# Altium schematic sheet CPU_100M_Ethernet.SchDoc: CPU_100M_Ethernet
size A3; PageSetup: Record=PageOptions|CenterHorizontal=True|CenterVertical=True|PrintScale=1.42|XCorrection=1.00|YCorrection=1.00|PrintKind=1|BorderSize=5000000|LeftOffset=0|BottomOffset=0|Orientation=2|PaperLength=1000|PaperWidth=1000|Scale=100|PaperSource=7|PrintQuality=-4|MediaType=1|DitherType=10|PaperKind=A3|PrintScaleMode=1; Date: 18/06/2014; DrawnBy: J. Gabriel R.E.; Organization: Seven Solutions S.L.; Address1: C/Baza, Parcela 19, Nave 3; Address2: Polнgono Ind. Juncaril; Address3: 18210-Peligros-Granada; Address4: Spain; Revision: 3.4; SheetNumber: 6; SheetTotal: 23; WebAddress: www.sevensols.com; Project: White Rabbit; ProjectName: Project Name
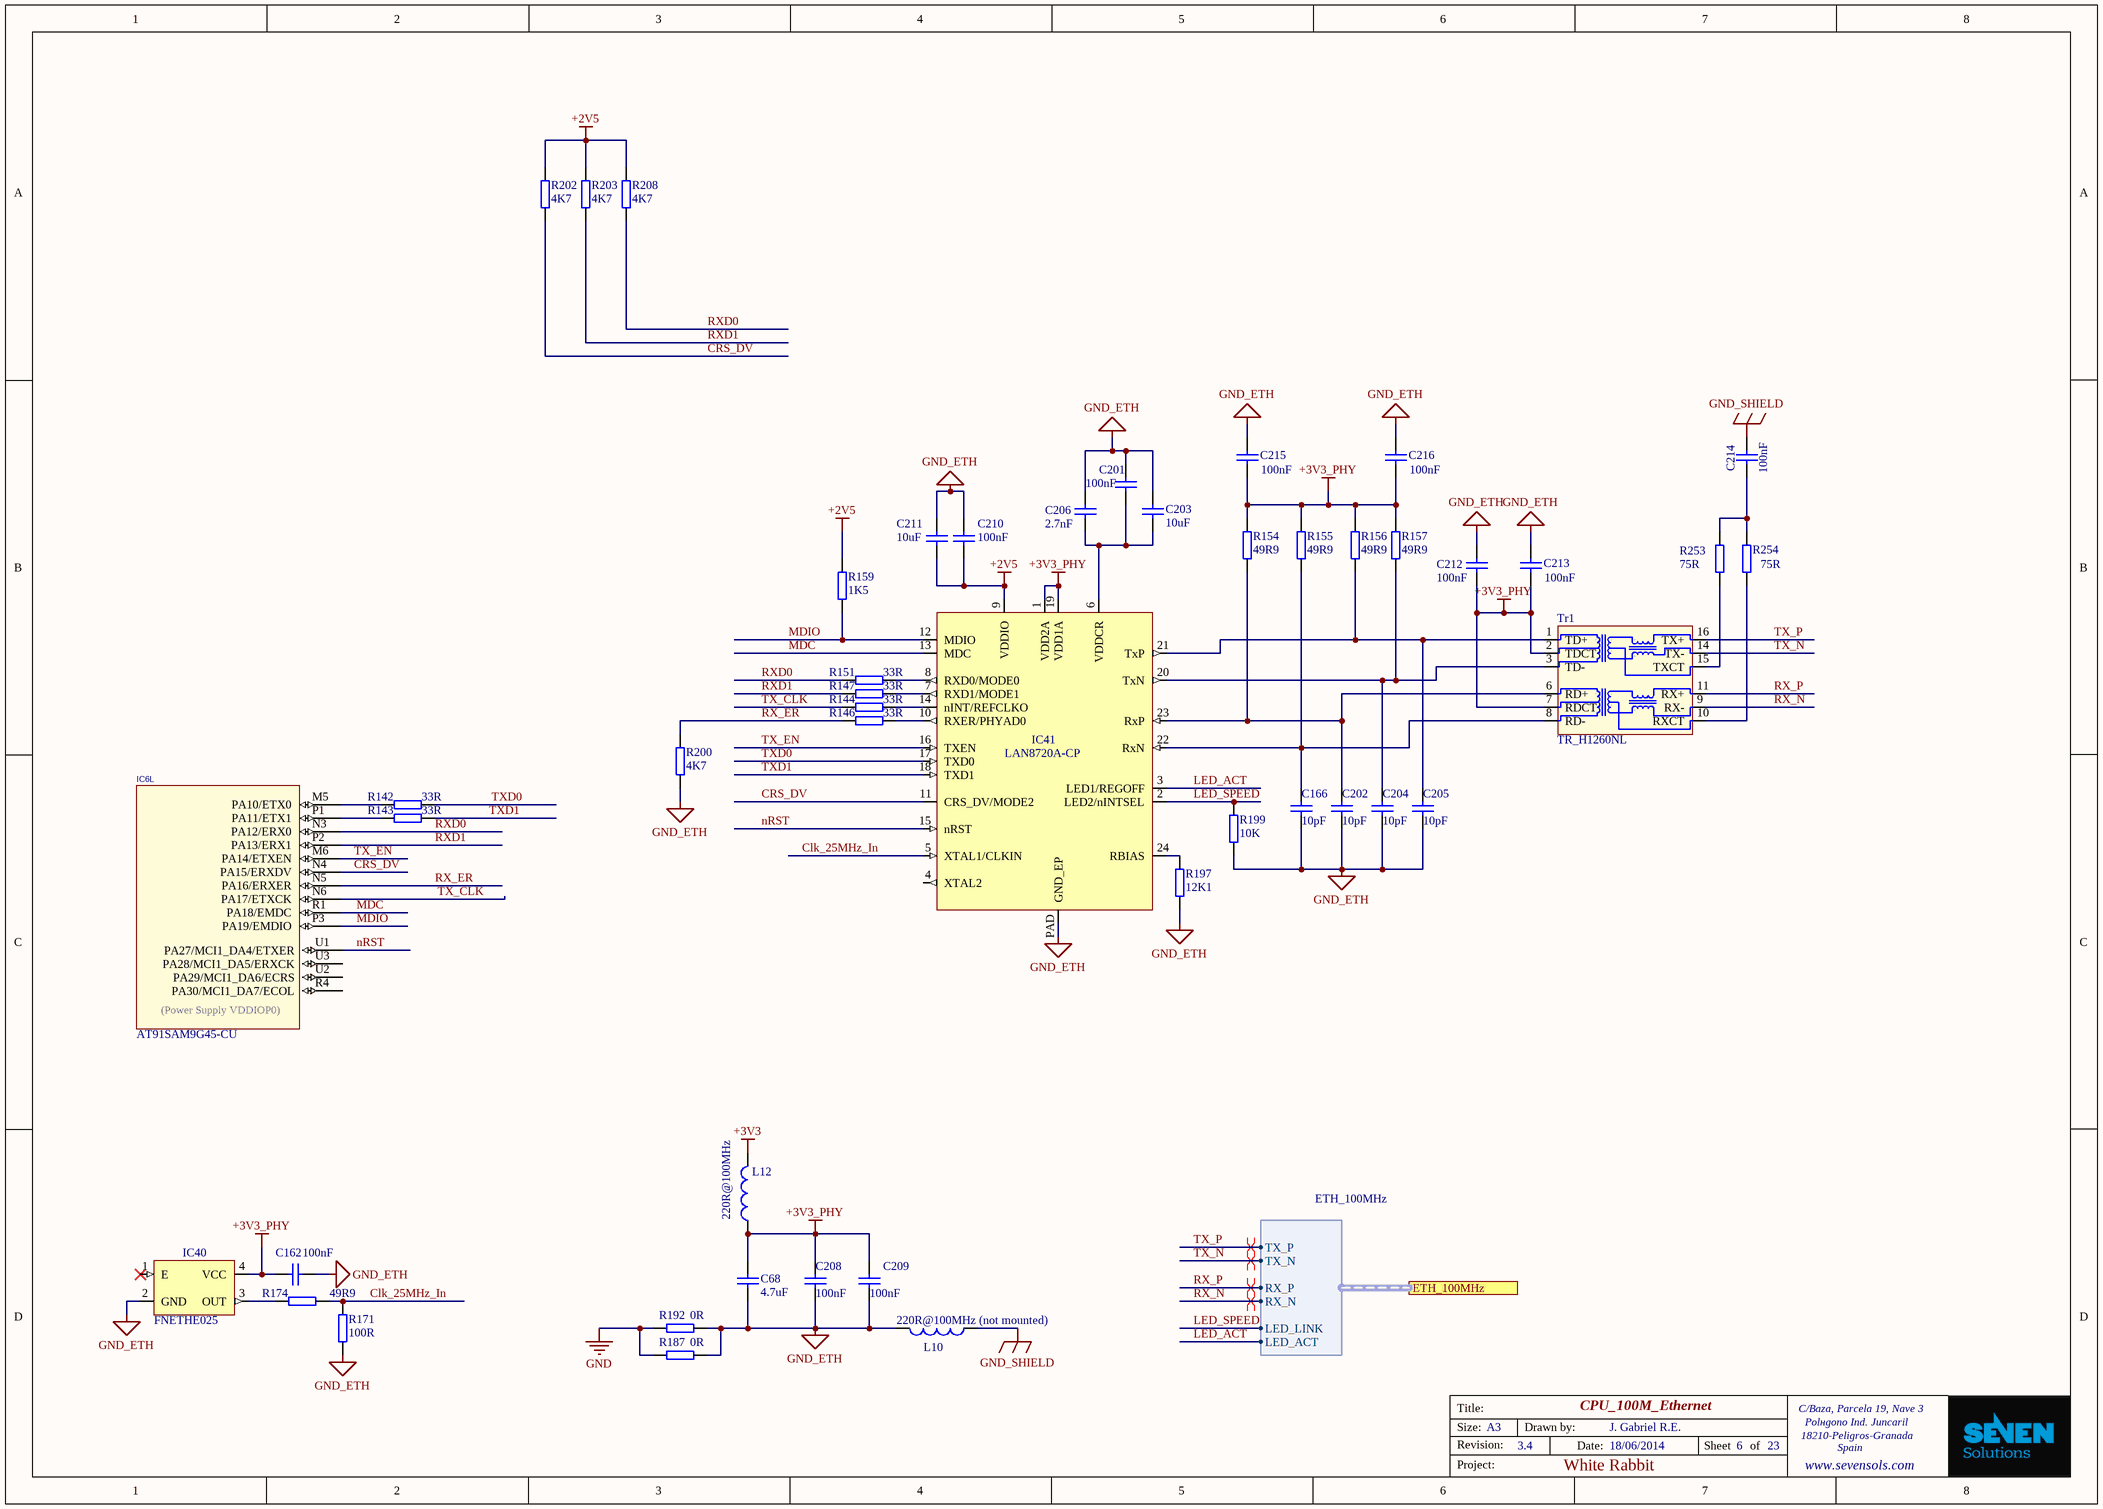
[diagram p0: CPU_100M_Ethernet.SchDoc]

## Parts
C68  4.7uF  [CC1608-0603]
C162  100nF  [CC1005-0402]
C166  10pF  [CC1005-0402]
C201  100nF  [CC1005-0402]
C202  10pF  [CC1005-0402]
C203  10uF  [CC1608-0603]
C204  10pF  [CC1005-0402]
C205  10pF  [CC1005-0402]
C206  2.7nF  [CC1005-0402]
C208  100nF  [CC1005-0402]
C209  100nF  [CC1005-0402]
C210  100nF  [CC1005-0402]
C211  10uF  [CC1608-0603]
C212  100nF  [CC1005-0402]
C213  100nF  [CC1005-0402]
C214  100nF  [CAPR500-250X720X650]
C215  100nF  [CC1005-0402]
C216  100nF  [CC1005-0402]
IC6  AT91SAM9G45-CU  [TFBGA324]  (part L of 12)
IC40  FNETHE025  [SPXO]
IC41  LAN8720A-CP  [QFN50P400X400-24W4M]
L10  Impedance: 220R@100MHz (not mounted)  [0603]  (hidden comment: 220R@100MHz Ferrite Bead)
L12  Impedance: 220R@100MHz  [0603]  (hidden comment: 220R@100MHz Ferrite Bead)
R142  33R  [0402]
R143  33R  [0402]
R144  33R  [0402]
R146  33R  [0402]
R147  33R  [0402]
R151  33R  [0402]
R154  49R9  [0603]
R155  49R9  [0603]
R156  49R9  [0603]
R157  49R9  [0603]
R159  1K5  [0402]
R171  100R  [0402]
R174  49R9  [0402]
R187  value 0R  [0402]  (hidden comment: Jumper)
R192  value 0R  [0402]  (hidden comment: Jumper)
R197  12K1  [0402]
R199  10k  [0402]
R200  4K7  [0402]
R202  4K7  [0402]
R203  4K7  [0402]
R208  4K7  [0402]
R253  75R  [0402]
R254  75R  [0402]
Tr1  TR_H1260NL  [H1260NL]

## Ports
ETH_100MHz (harness ETH_100MHz)

## Harnesses
ETH_100MHz: RX_P, TX_P, TX_N, RX_N, LED_LINK, LED_ACT

## Nets
+2V5: C210.2 C211.2 IC41.9(VDDIO) R159.2 R202.2 R203.2 R208.2
+3V3: L12.2
+3V3_PHY: C68.2 C162.2 C208.1 C209.1 C212.1 C213.1 C215.1 C216.1 IC40.4(VCC) IC41.1(VDD2A) IC41.19(VDD1A) L12.1 R154.2 R155.2 R156.2 R157.2 Tr1.2(TDCT) Tr1.7(RDCT)
GND: R187.2 R192.2
GND_ETH: C68.1 C162.1 C166.1 C201.1 C202.1 C203.1 C204.1 C205.1 C206.1 C208.2 C209.2 C210.1 C211.1 C212.2 C213.2 C215.2 C216.2 IC40.2(GND) IC41.PAD(GND_EP) L10.2 R171.1 R187.1 R192.1 R197.2 R199.1 R200.2
GND_SHIELD: C214.2 L10.1
Clk_25MHz_In: IC41.5(XTAL1/CLKIN) R171.2 R174.1
CRS_DV: IC6.N4(PA15/ERXDV) IC41.11(CRS_DV/MODE2) R202.1
LED_ACT: IC41.3(LED1/REGOFF) ; port ETH_100MHz.LED_ACT
LED_SPEED: IC41.2(LED2/nINTSEL) R199.2 ; port ETH_100MHz.LED_LINK
MDC: IC6.R1(PA18/EMDC) IC41.13(MDC)
MDIO: IC6.P3(PA19/EMDIO) IC41.12(MDIO) R159.1
nRST: IC6.U1(PA27/MCI1_DA4/ETXER) IC41.15(nRST)
RX_ER: IC6.N5(PA16/ERXER) R146.1 R200.1
RX_N: Tr1.9(RX-) ; port ETH_100MHz.RX_N
RX_P: Tr1.11(RX+) ; port ETH_100MHz.RX_P
RXD0: IC6.N3(PA12/ERX0) R151.1 R208.1
RXD1: IC6.P2(PA13/ERX1) R147.1 R203.1
TX_CLK: IC6.N6(PA17/ETXCK) R144.1
TX_EN: IC6.M6(PA14/ETXEN) IC41.16(TXEN)
TX_N: Tr1.14(TX-) ; port ETH_100MHz.TX_N
TX_P: Tr1.16(TX+) ; port ETH_100MHz.TX_P
TXD0: IC41.17(TXD0) R142.2
TXD1: IC41.18(TXD1) R143.2
NetC166_2: C166.2 IC41.22(RxN) R155.1 Tr1.8(RD-)
NetC201_2: C201.2 C203.2 C206.2 IC41.6(VDDCR)
NetC202_2: C202.2 IC41.23(RxP) R154.1 Tr1.6(RD+)
NetC204_2: C204.2 IC41.20(TxN) R157.1 Tr1.3(TD-)
NetC205_2: C205.2 IC41.21(TxP) R156.1 Tr1.1(TD+)
NetC214_1: C214.1 R253.2 R254.2
NetIC6_M5: IC6.M5(PA10/ETX0) R142.1
NetIC6_P1: IC6.P1(PA11/ETX1) R143.1
NetIC40_3: IC40.3(OUT) R174.2
NetIC41_7: IC41.7(RXD1/MODE1) R147.2
NetIC41_8: IC41.8(RXD0/MODE0) R151.2
NetIC41_10: IC41.10(RXER/PHYAD0) R146.2
NetIC41_14: IC41.14(nINT/REFCLKO) R144.2
NetIC41_24: IC41.24(RBIAS) R197.1
NetR253_1: R253.1 Tr1.15(TXCT)
NetR254_1: R254.1 Tr1.10(RXCT)

Not connected (* = marked no-connect by the designer): IC6 R4(PA30/MCI1_DA7/ECOL) U2(PA29/MCI1_DA6/ECRS) U3(PA28/MCI1_DA5/ERXCK); IC40 1(E)*; IC41 4(XTAL2)

## Layout directives
differential pair: RX_N, RX_P, TX_N, TX_P

## Notes on the sheet
- Title:
- Size:
- Revision:
- A3
- Drawn by:
- Date:
- Sheet
- of
- Project:
- (in symbol AT91SAM9G45-CU, part L) (Power Supply VDDIOP0)

## Library data of the parts
C68 = CC0603_4.7UF_10V_10%_X5R: Capacitor; Manufacturer1: TDK; Manufacturer1 PN: C1608X5R1A475K; TC: X5R; Tolerance: ±10%; Voltage: 10V; Published: 8-Jun-2000; LatestRevisionDate: 17-Jul-2002; LatestRevisionNote: Re-released for DXP Platform.; PackageReference: RAD-0.3; Publisher: Altium Limited; Distributor1: Digikey; Distributor1 PN: 445-5170-1-ND; Case: 0603; Value: 4.7uF
C162 C201 C208-C210 C212 C213 C215 C216 = CC0402_100NF_16V_10%_X7R: Capacitor; Manufacturer1: TDK; Manufacturer1 PN: C1005X7R1C104K; TC: X7R; Tolerance: ±10%; Voltage: 16V; Published: 8-Jun-2000; LatestRevisionDate: 17-Jul-2002; LatestRevisionNote: Re-released for DXP Platform.; PackageReference: RAD-0.3; Publisher: Altium Limited; Distributor1: Digikey; Distributor1 PN: 445-4952-1-ND; Case: 0402; Value: 100nF
C166 C202 C204 C205 = CC0402_10PF_50V_5%_NP0: Capacitor; Manufacturer1: TDK; Manufacturer1 PN: C1005C0G1H100D; TC: NPO; Tolerance: ±10%; Voltage: 50V; Published: 8-Jun-2000; LatestRevisionDate: 17-Jul-2002; LatestRevisionNote: Re-released for DXP Platform.; PackageReference: RAD-0.3; Publisher: Altium Limited; Distributor1: Digikey; Distributor1 PN: 445-1235-1-ND; Case: 0402; Value: 10pF
C203 C211 = CC0603_10UF_6.3V_20%_X5R: Capacitor; Manufacturer1: TDK; Manufacturer1 PN: C1608X5R0J106M; TC: X5R; Tolerance: ±20%; Voltage: 6.3V; Published: 8-Jun-2000; LatestRevisionDate: 17-Jul-2002; LatestRevisionNote: Re-released for DXP Platform.; PackageReference: RAD-0.3; Publisher: Altium Limited; Distributor1: Digikey; Distributor1 PN: 445-4112-1-ND; Case: 0603; Value: 10uF
C206 = CC0402_2.7NF_50V_10%_X7R: Capacitor; Manufacturer1: Panasonic; Manufacturer1 PN: ECJ-0EB1H272K; TC: X7R; Tolerance: ±10%; Voltage: 50V; Published: 8-Jun-2000; LatestRevisionDate: 17-Jul-2002; LatestRevisionNote: Re-released for DXP Platform.; PackageReference: RAD-0.3; Publisher: Altium Limited; Distributor1: Digikey; Distributor1 PN: PCC1726CT-ND; Case: 0402; Value: 2.7nF
C214 = CPER_100NF_100V_10%_500-250X720X650: Non-polarised capacitor; Part Description: Metallized Polyester Film Capacitor (MKT); Manufacturer: EPCOS; Manufacturer Part Number: B32529C1104K000; Voltage: 100VDC/63VAC; Tolerance: ±10%; Table: Capacitors THD; Part Number: CPER_100NF_100V_10%_500-250X720X650; Component Kind: Standard; Component Type: Standard; Pin Count: 2; Value: 100nF; Status: None; Case: LS5 W2.5 x L7.2 x H6.5; Mounted: Yes; Socket: No; SMD: No; ComponentHeight: 6.5mm; HelpURL: \\cern.ch\dfs\Applications\Altium\Datasheets\CPER_EPCOS_B32529.pdf; Author: CERN DEM JLC; CreateDate: 3/22/2010; LatestRevisionDate: 3/22/2010
IC6 = AT91SAM9G45-CU: Atmel 400MHz ARM926 MCU; Value: AT91SAM9G45-CU; Distributor1 PN: AT91SAM9G45-CU-ND; Distributor1: Digikey
IC40 = OSC_CFPS-73: SMD oscillator 3.3V (Elfa); Value: FNETHE025; Distributor: Digikey; Distributor PN: FNETHE025CT-ND
IC41 = LAN8720A-CP: RMII ethernet transceiver with auto MIDIX; Manufacturer: SMSC; Value: LAN8720A-CP; Distributor1: Digikey; Distributor1 PN: 638-1080-ND
L10 = L_FERRITE_BEAD: ferrite bead; Manufacturer1: Murata; Manufacturer1 PN: BLM18KG221SN1D; Current Rating: 2.2A; DCR: 50mOhm; Mounted: No; Case: 0603; Distributor1: Digikey; Distributor1 PN: 490-5255-1-ND
L12 = L_FERRITE_BEAD: ferrite bead; Manufacturer1: Murata; Manufacturer1 PN: BLM18KG221SN1D; Current Rating: 2.2A; DCR: 50mOhm; Case: 0603; Distributor1: Digikey; Distributor1 PN: 490-5255-1-ND
R142-R144 R146 R147 R151 = R0402_33R_±1%_0.1W_100PPM: SMD Resistor; Manufacturer1: Panasonic; Manufacturer1 PN: ERJ-2RKF33R0X; TCR: 100ppm; Power Rating: 0.1W; Tolerance: ±1%; Case: 0402; Distributor1: DigiKey; Distributor1 PN: P33.0LCT-ND; Value: 33R
R154-R157 = R0603_49R9_±1%_0.25W_100PPM: SMD Resistor; Manufacturer1: Vishay/Dale; Manufacturer1 PN: CRCW060349R9FKEAHP; TCR: 100ppm; Power Rating: 0.25W; Tolerance: ±1%; Case: 0603; Distributor1: DigiKey; Distributor1 PN: 541-49.9SCT-ND; Value: 49R9
R159 = R0402_1K5_±1%_0.1W_100PPM: SMD Resistor; Manufacturer1: Panasonic; Manufacturer1 PN: ERJ-2RKF1501X; TCR: 100ppm; Power Rating: 0.1W; Tolerance: ±1%; Case: 0402; Distributor1: DigiKey; Distributor1 PN: P1.50KLCT-ND; Value: 1K5
R171 = R0402_100R_±1%_0.1W_100PPM: SMD Resistor; Manufacturer1: Panasonic; Manufacturer1 PN: ERJ-2RKF1000X; TCR: 100ppm; Power Rating: 0.1W; Tolerance: ±1%; Case: 0402; Distributor1: DigiKey; Distributor1 PN: P100LCT-ND; Value: 100R
R174 = R0402_49R9_±1%_0.1W_100PPM: SMD Resistor; Manufacturer1: Panasonic; Manufacturer1 PN: ERJ-2RKF49R9X; TCR: 100ppm; Power Rating: 0.1W; Tolerance: ±1%; Case: 0402; Distributor1: DigiKey; Distributor1 PN: P49.9LCT-ND; Value: 49R9
R187 R192 = R0402_0R_0.1W_JUMPER: SMD Resistor; Manufacturer1: Panasonic; Manufacturer1 PN: ERJ-2GE0R00X; TCR: 100ppm; Power Rating: 0.1W; Case: 0402; Distributor1: DigiKey; Distributor1 PN: P0.0JCT-ND; Tolerance: Jumper
R197 = R0402_12K1_±1%_0.1W_100PPM: SMD Resistor; Manufacturer1: Panasonic; Manufacturer1 PN: ERJ-2RKF1212X; TCR: 100ppm; Power Rating: 0.1W; Tolerance: ±1%; Case: 0402; Distributor1: DigiKey; Distributor1 PN: P12.1KLCT-ND; Value: 12K1
R199 = R0402_10K_±1%_0.1W_100PPM: SMD Resistor; Manufacturer1: Panasonic; Manufacturer1 PN: ERJ-2RKF1002X; TCR: 100ppm; Power Rating: 0.1W; Tolerance: ±1%; Case: 0402; Distributor1: DigiKey; Distributor1 PN: P10.0KLCT-ND; Value: 10K
R200 R202 R203 R208 = R0402_4.7K_±1%_0.1W_100PPM: SMD Resistor; Manufacturer1: Panasonic; Manufacturer1 PN: ERJ-2RKF4701X; TCR: 100ppm; Power Rating: 0.1W; Tolerance: ±1%; Case: 0402; Distributor1: DigiKey; Distributor1 PN: ERJ-2RKF4701X; Value: 4K7
R253 R254 = R0402_75R_±1%_0.1W_100PPM: SMD Resistor; Manufacturer1: Panasonic; Manufacturer1 PN: ERJ-2RKF75R0X; TCR: 100ppm; Power Rating: 0.1W; Tolerance: ±1%; Case: 0402; Distributor1: DigiKey; Distributor1 PN: P75.0LCT-ND; Value: 75R
Tr1 = TR_H1260NL: ethernet trafo (TME); Value: H1260NL; Distributor1 PN: 553-1328-ND; Distributor1: Digikey